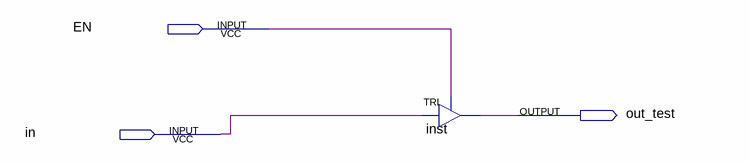
[diagram p0: schematic sheet]
// Quartus schematic test.bdf as structural Verilog: 1 symbols, 3 pins
module test (
  input  EN,
  input  in,
  output out_test
);

  TRI inst (.IN(in), .OE(EN), .OUT(out_test));
endmodule
